# Altium schematic sheet MouseSensor.SchDoc
size Letter; CompanyName: Ploopy Corporation; Organization: Ploopy Corporation; Address1: 137-1140 Burnhamthorpe Road W; Address2: Mississauga; Address3: Ontario; Address4: Canada L5C 0A3; DocumentNumber: 7; Revision: R2.003; SheetNumber: 7; SheetTotal: 8
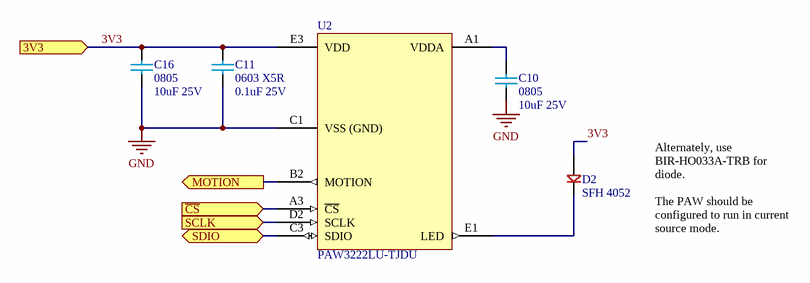
[diagram p0: MouseSensor.SchDoc]

## Parts
C10  0805  value 10uF 25V  [0805]
C11  0603 X5R  value 0.1uF 25V  [0603 capacitor - CAPC1608X06N]
C16  0805  value 10uF 25V  [0805]
D2  SFH 4052  [Osram SFH 4052 - DIOC3216X12M]
U2  PAW3222LU-TJDU  [PAW3222LU-TJDU - BGA15C30P3X5_155X189X72]

## Ports
3V3 (in), MOTION (out), SCLK (in), SDIO (bidir), ~{CS} (in)

## Nets
GND: C10.1 C11.1 C16.1 U2.C1(VSS_(GND))
3V3: C11.2 C16.2 D2.A U2.E3(VDD) ; port 3V3
~{CS}: U2.A3(~{CS}) ; port ~{CS}
MOTION: U2.B2(MOTION) ; port MOTION
SCLK: U2.D2(SCLK) ; port SCLK
SDIO: U2.C3(SDIO) ; port SDIO
NetC10_2: C10.2 U2.A1(VDDA)
NetD2_C: D2.C U2.E1(LED)

## Notes on the sheet
- Alternately, use BIR-HO033A-TRB for diode.
  The PAW should be configured to run in current source mode.
- Copyright Ploopy Corporation 2024
- Licensed under the CERN-OHL-S v2
- http://ohwr.org/cernohl
- Title:
- PCB:
- Version:
- Ploopy Corporation
- Mississauga ON L5C 0A3
- 137-1140 Burnhamthorpe Road W
- Date:
- Time:
- Sheet
- of
- Canada

## Library data of the parts
C10 C16 = Cap 10uF 25V: 0805, X5R or better; PNP-Nzl: 2; PNP-dx: 0; PNP-X: 2.00; PNP-Y: 1.25; PNP-Lv: 1; PNP-TS: 70; PNP-Type: chi; PNP-FeedType: Tape; PNP-TapeWidth: 8; PNP-dy: 0; PNP-Pt: 0; PNP-W: 0; PNP-Thk: 1.25; PNP-Level: 1; PNP-Voff: 0; PNP-PlacePriority: 1; PNP-A: 0; PNP-TapeIndex: 1; Supplier 1: Mouser; Supplier Part Number 1: 81-GRM21BR61E106KA3L; Supplier 2: Digi-Key; Supplier Part Number 2: 490-5523-1-ND; PNP-da: 0
C11 = Cap 0.1uF 25V: 0603, X5R or better; Supplier 1: Digi-Key; Supplier Part Number 1: 1276-6840-2-ND
D2 = SFH 4052: Infrared (IR) Emitter 850nm 1206
U2 = PAW3222LU-TJDU: Ultra Low Power Wireless Mouse Chip